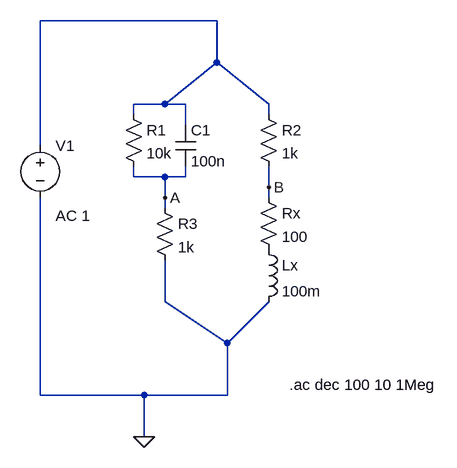
[diagram p0: schematic Maxwell Bridge Nw.asc]
Maxwell Bridge Nw.asc, the LTspice schematic file:
Version 4
SHEET 1 880 680
WIRE 256 -128 -16 -128
WIRE 256 -64 256 -128
WIRE 176 0 256 -64
WIRE 176 0 128 0
WIRE 208 0 176 0
WIRE 336 0 256 -64
WIRE 128 16 128 0
WIRE 336 16 336 0
WIRE 208 32 208 0
WIRE -16 64 -16 -128
WIRE 128 112 128 96
WIRE 176 112 128 112
WIRE 208 112 208 96
WIRE 208 112 176 112
WIRE 336 128 336 96
WIRE 176 144 176 112
WIRE 336 144 336 128
WIRE 176 160 176 144
WIRE 176 304 176 240
WIRE 272 368 176 304
WIRE 272 368 336 304
WIRE -16 448 -16 144
WIRE 144 448 -16 448
WIRE 272 448 272 368
WIRE 272 448 144 448
WIRE 144 512 144 448
FLAG 144 512 0
FLAG 176 144 A
FLAG 336 128 B
SYMBOL res 112 0 R0
SYMATTR InstName R1
SYMATTR Value 10k
SYMBOL cap 192 32 R0
SYMATTR InstName C1
SYMATTR Value 100n
SYMBOL res 320 0 R0
SYMATTR InstName R2
SYMATTR Value 1k
SYMBOL res 160 144 R0
SYMATTR InstName R3
SYMATTR Value 1k
SYMBOL res 320 128 R0
SYMATTR InstName Rx
SYMATTR Value 100
SYMBOL ind 320 208 R0
SYMATTR InstName Lx
SYMATTR Value 100m
SYMBOL voltage -16 48 R0
WINDOW 123 24 124 Left 2
WINDOW 39 0 0 Left 0
SYMATTR InstName V1
SYMATTR Value ""
SYMATTR Value2 AC 1
TEXT 368 432 Left 2 !.ac dec 100 10 1Meg

The netlist it stands for:
* Maxwell Bridge Nw.asc
R1 N001 A 10k
C1 N001 A 100n
R2 N001 B 1k
R3 A 0 1k
Rx B P001 100
Lx P001 0 100m
V1 N001 0 AC 1
.ac dec 100 10 1Meg
.backanno
.end